# Altium schematic sheet CATS_GS-Radio.SchDoc: CATS Groundstation
size A4; DocumentNumber: Subtitle; Revision: V1.0; SheetNumber: 8; SheetTotal: 9; Author: Luca Jost; Subtitle: Radio
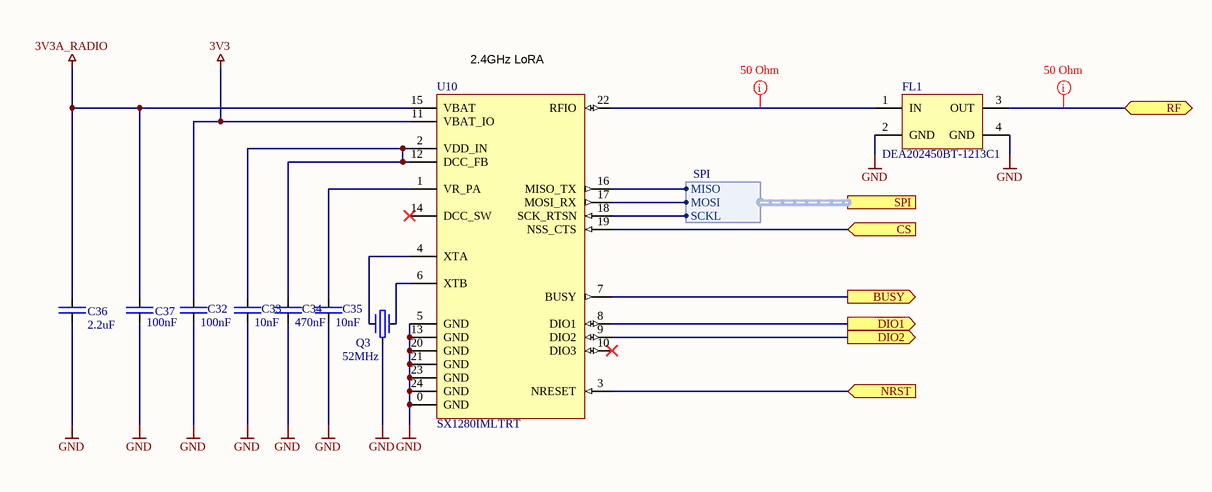
[diagram p0: CATS_GS-Radio.SchDoc]

## Parts
C32  100nF  [SMD Keramikkondensator 0402]
C33  10nF  [SMD Keramikkondensator 0402]
C34  470nF  [SMD Keramikkondensator 0402]
C35  10nF  [SMD Keramikkondensator 0402]
C36  2.2uF  [SMD Keramikkondensator 0402]
C37  100nF  [SMD Keramikkondensator 0402]
FL1  DEA202450BT-1213C1  [SMD Filter DEA202450BT]
Q3  52MHz  [SMD Crystal 2520]
U10  SX1280IMLTRT  [SMD IC QFN-24]

## Ports
BUSY (out), CS (in), DIO1 (out), DIO2 (out), NRST (in), RF (bidir), SPI (harness SPI)

## Harnesses
SPI: SCKL, MOSI, MISO

## Nets
3V3: C32.2 U10.11(VBAT_IO)
3V3A_RADIO: C36.2 C37.2 U10.15(VBAT)
GND: C32.1 C33.1 C34.1 C35.1 C36.1 C37.1 FL1.2(GND) FL1.4(GND) Q3.3 U10.0(GND) U10.5(GND) U10.13(GND) U10.20(GND) U10.21(GND) U10.23(GND) U10.24(GND)
BUSY: U10.7(BUSY) ; port BUSY
CS: U10.19(NSS_CTS) ; port CS
DIO1: U10.8(DIO1) ; port DIO1
DIO2: U10.9(DIO2) ; port DIO2
NRST: U10.3(NRESET) ; port NRST
RF: FL1.3(OUT) ; port RF
NetC33_2: C33.2 C34.2 U10.2(VDD_IN) U10.12(DCC_FB)
NetC35_2: C35.2 U10.1(VR_PA)
NetFL1_1: FL1.1(IN) U10.22(RFIO)
NetQ3_1: Q3.1 U10.4(XTA)
NetQ3_2: Q3.2 U10.6(XTB)
NetU10_16: U10.16(MISO_TX) ; port SPI.MISO
NetU10_17: U10.17(MOSI_RX) ; port SPI.MOSI
NetU10_18: U10.18(SCK_RTSN) ; port SPI.SCKL

Not connected (* = marked no-connect by the designer): U10 10(DIO3)* 14(DCC_SW)*

## Layout directives
rule Impedance Constraint [Min = 50.00    Max = 50.00    ]; net class RF-Line 50: NetFL1_1, RF

## Notes on the sheet
- (near U10) 2.4GHz LoRA
- Title
- Author:
- Subtitle
- Date:
- Rev:
- File:
- Sheet
- of

## Library data of the parts
C32 C37 = E6 - 100nF: SMD Ceramic Capacitor E6; Unit Price: 0.01; JLC: C307331
C33 C35 = E6 - 10nF: SMD Ceramic Capacitor E6; Unit Price: 0.01; JLC: C15195
C34 = E6 - 470nF: SMD Ceramic Capacitor E6; Unit Price: 0.01; JLC: C47339
C36 = E6 - 2.2uF: SMD Ceramic Capacitor E6; Unit Price: 0.01; JLC: C193620
FL1 = DEA202450BT-1213C1: Multilayer Band Pass Filter 2400-2500MHz; ComponentLink1Description: Datasheet; ComponentLink1URL: https://datasheet.lcsc.com/lcsc/1811021613_TDK-DEA202450BT-1213C1_C307898.pdf; JLC: C307898
Q3 = Crystal 52MHz - 2520: 52Mhz Ceramic 2.5 x 2.0mm SMD 10pF 60Ω ±10ppm; JLC: C963550; ComponentLink1Description: Datasheet; ComponentLink1URL: https://datasheet.lcsc.com/lcsc/2012211835_WTL-WTL2M75523TW_C963550.pdf; Unit Price: 0.39
U10 = SX1280IMLTRT: Long Range, Low Power, 2.4 GHz / Transceiver with Ranging Capability; ComponentLink1Description: Datasheet; ComponentLink1URL: https://media.digikey.com/pdf/Data%20Sheets/Semtech%20PDFs/SX1280-81_Rev3.2_Mar2020.pdf; Digikey: SX1280IMLTRTCT-ND; JLC: C125969; Unit Price: 3.20